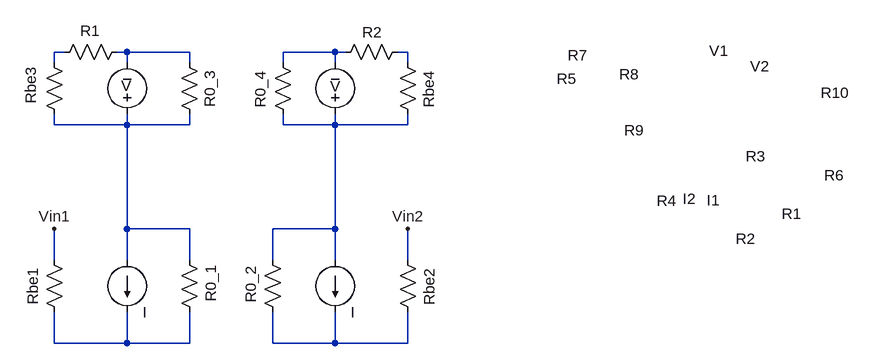
[diagram p0: schematic Draft1.asc]
Draft1.asc, the LTspice schematic file:
Version 4
SHEET 1 1300 680
WIRE 48 -192 32 -192
WIRE 144 -192 128 -192
WIRE 240 -192 144 -192
WIRE 464 -192 384 -192
WIRE 480 -192 464 -192
WIRE 576 -192 560 -192
WIRE 32 -176 32 -192
WIRE 144 -176 144 -192
WIRE 240 -176 240 -192
WIRE 384 -176 384 -192
WIRE 464 -176 464 -192
WIRE 576 -176 576 -192
WIRE 32 -80 32 -96
WIRE 144 -80 144 -96
WIRE 144 -80 32 -80
WIRE 240 -80 240 -96
WIRE 240 -80 144 -80
WIRE 384 -80 384 -96
WIRE 464 -80 464 -96
WIRE 464 -80 384 -80
WIRE 576 -80 576 -96
WIRE 576 -80 464 -80
WIRE 144 80 144 -80
WIRE 240 80 144 80
WIRE 464 80 464 -80
WIRE 464 80 368 80
WIRE 32 128 32 80
WIRE 144 128 144 80
WIRE 240 128 240 80
WIRE 368 128 368 80
WIRE 464 128 464 80
WIRE 576 128 576 80
WIRE 32 256 32 208
WIRE 144 256 144 208
WIRE 144 256 32 256
WIRE 240 256 240 208
WIRE 240 256 144 256
WIRE 368 256 368 208
WIRE 464 256 464 208
WIRE 464 256 368 256
WIRE 576 256 576 208
WIRE 576 256 464 256
FLAG 32 80 Vin1
FLAG 576 80 Vin2
SYMBOL res 16 112 R0
WINDOW 0 1135 -55 Left 2
WINDOW 3 -17 27 VRight 2
SYMATTR InstName R1
SYMATTR Value Rbe1
SYMBOL res 560 112 R0
WINDOW 0 520 -17 Left 2
WINDOW 3 49 28 VRight 2
SYMATTR InstName R2
SYMATTR Value Rbe2
SYMBOL current 464 128 R0
WINDOW 0 572 -92 Left 2
SYMATTR InstName I1
SYMBOL current 144 128 R0
WINDOW 0 855 -94 Left 2
SYMATTR InstName I2
SYMBOL res 224 112 R0
WINDOW 0 872 -144 Left 2
WINDOW 3 49 80 VLeft 2
SYMATTR InstName R3
SYMATTR Value R0_1
SYMBOL res 352 112 R0
WINDOW 0 607 -75 Left 2
WINDOW 3 -18 82 VLeft 2
SYMATTR InstName R4
SYMATTR Value R0_2
SYMBOL res 560 -192 R0
WINDOW 0 245 41 Left 2
WINDOW 3 48 28 VRight 2
SYMATTR InstName R5
SYMATTR Value Rbe4
SYMBOL res 576 -208 R90
WINDOW 0 221 -656 VBottom 2
WINDOW 3 -30 55 VTop 2
SYMATTR InstName R6
SYMATTR Value R2
SYMBOL res 368 -192 R0
WINDOW 0 454 5 Left 2
WINDOW 3 -19 28 VRight 2
SYMATTR InstName R7
SYMATTR Value R0_4
SYMBOL res 224 -192 R0
WINDOW 0 677 34 Left 2
WINDOW 3 47 27 VRight 2
SYMATTR InstName R8
SYMATTR Value R0_3
SYMBOL res 16 -192 R0
WINDOW 0 893 120 Left 2
WINDOW 3 -20 22 VRight 2
SYMATTR InstName R9
SYMATTR Value Rbe3
SYMBOL res 144 -208 R90
WINDOW 0 94 -1089 VBottom 2
WINDOW 3 -32 57 VTop 2
SYMATTR InstName R10
SYMATTR Value R1
SYMBOL voltage 144 -80 R180
WINDOW 0 -925 114 Left 2
WINDOW 3 -7 60 Left 2
SYMATTR InstName V1
SYMBOL voltage 464 -80 R180
WINDOW 0 -668 90 Left 2
WINDOW 3 -8 59 Left 2
SYMATTR InstName V2

The netlist it stands for:
* Draft1.asc
R1 Vin1 N007 Rbe1
R2 Vin2 N008 Rbe2
I1 N006 N008 I
I2 N005 N007 I
R3 N005 N007 R0_1
R4 N006 N008 R0_2
R5 N004 N006 Rbe4
R6 N004 N003 R2
R7 N003 N006 R0_4
R8 N002 N005 R0_3
R9 N001 N005 Rbe3
R10 N002 N001 R1
V1 N005 N002 V
V2 N006 N003 V
.backanno
.end